# EasyEDA Pro project stm32h7手持mp3.eprj, board PCB2
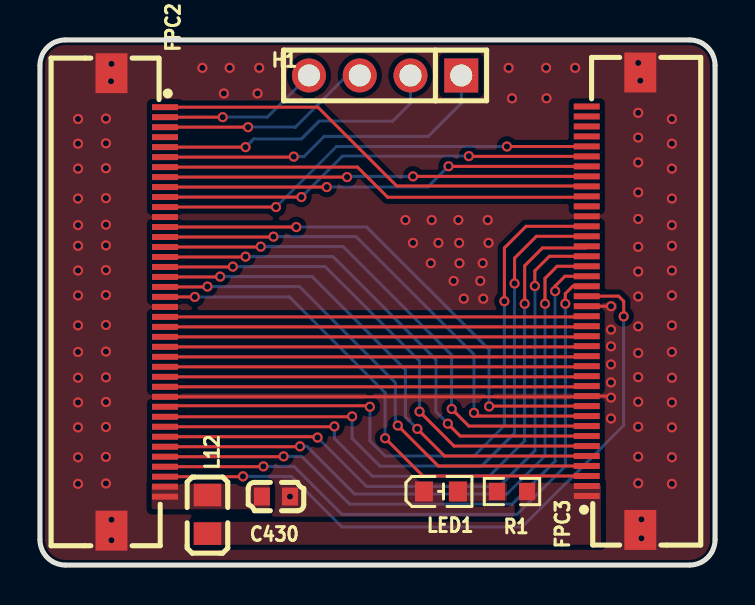
[diagram p4: board, top side]
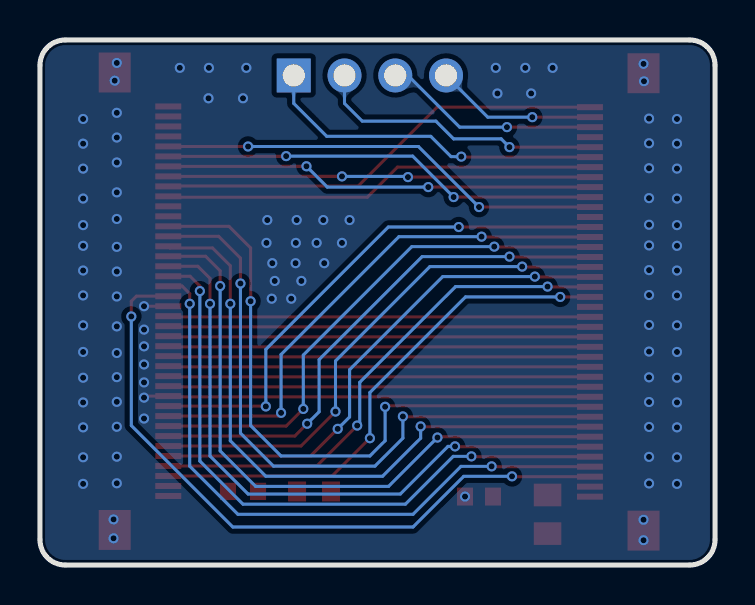
[diagram p5: board, bottom side, seen from below]

Outline 33.78 x 26.29 mm; copper layers: Top Layer, Bottom Layer. Coordinates in mm from the lower left corner of the outline.
Outline path: 0,25.02 0,1.27 arc(0.37,0.37) 1.27,0 32.51,0 arc(33.41,0.37) 33.78,1.27 33.78,25.02 arc(33.41,25.92) 32.51,26.29 1.27,26.29 arc(0.37,25.92) 0,25.02
Stack: Top Layer 0.035mm / Dielectric1 1.51mm FR4 er 4.5 / Bottom Layer 0.035mm

## Design rules (mm)
template: 自定义配置
spacing copperThickness1oz (default): track to track 0.102, other pairs 0.152 to 0.3
spacing copperThickness2oz: track to track 0.203, other pairs 0.152 to 0.3
track width copperThickness1oz (default): min 0.127, default 0.254, max 2.54
track width copperThickness2oz: min 0.203, default 0.254, max 2.54
differential pair differentialPair (default): width min 0.127, default 0.254, max 2.54; gap min 0.152, default 0.152
via viaSize (default): diameter min 0.5, default 0.61, max 10; hole min 0.3, default 0.305, max 6.3

## Placement (name value [footprint] x y rotation side)
C430  100nF  [C0603]  11.81 3.43 0 top
FPC2  AFC01-S40FCA-00  [FPC-SMD_AFC01-S40FCA-00]  4.92 13.17 270 top
FPC3  AFC01-S40FCA-00  [FPC-SMD_AFC01-S40FCA-00]  28.7 13.21 90 top
H1  PZ254V-11-04P  [HDR-TH_4P-P2.54-V-M]  17.27 24.51 180 top
L12  BLM21PG331SN1D  [L0805]  8.38 2.54 90 top
LED1  GL0603UR01  [LED0603-FD]  20.07 3.68 180 top
R1  1K  [R0603]  23.62 3.68 0 top

## Footprints (pads in the part's own frame, mm; a bottom-side part is the same pattern mirrored in y, then rotated)
C0603
  rect 0.8x0.9 smd: 1(-0.7,0) 2(0.7,0)
FPC-SMD_AFC01-S40FCA-00
  rect 0.3x1.3 smd: 1(-9.75,1.34) 2(-9.25,1.339) 3(-8.75,1.34) 4(-8.25,1.34) 5(-7.75,1.34) 6(-7.25,1.34) 7(-6.75,1.34) 8(-6.25,1.34) 9(-5.75,1.34) 10(-5.25,1.34) 11(-4.75,1.34) 12(-4.25,1.34) 13(-3.75,1.34) 14(-3.25,1.34) 15(-2.75,1.34) 16(-2.25,1.34) 17(-1.75,1.34) 18(-1.25,1.34) 19(-0.75,1.34) 20(-0.25,1.34) 21(0.25,1.34) 22(0.75,1.34) 23(1.25,1.34) 24(1.75,1.34) 25(2.25,1.34) 26(2.75,1.34) 27(3.25,1.34) 28(3.75,1.34) 29(4.25,1.34) 30(4.75,1.34) 31(5.25,1.34) 32(5.75,1.34) 33(6.25,1.34) 34(6.75,1.34) 35(7.25,1.34) 36(7.75,1.34) 37(8.25,1.34) 38(8.75,1.34) 39(9.25,1.34) 40(9.75,1.34)
  rect 2x1.6 smd: 41(-11.45,-1.34) 42(11.45,-1.34)
HDR-TH_4P-P2.54-V-M
  rect 1.7x1.7 hole 1.1: 1(-3.81,0)
  round 1.7 hole 1.1: 2(-1.27,0) 3(1.27,0) 4(3.81,0)
L0805
  rect 1.133x1.377 smd: 1(-0.966,0) 2(0.966,0)
LED0603-FD
  rect 0.9x1 smd: 1(-0.85,0) 2(0.85,0)
R0603
  rect 0.806x0.864 smd: 1(-0.753,0) 2(0.753,0)

## Nets
As in the schematic.

Pads without a net: FPC3 30 37 38 39 40

## Via types
v1: diameter 0.508, hole 0.305, Top Layer to Bottom Layer, 145 vias

## Routing (per net, layer and track width the routed paths; a pad name or vN(x,y) marks a point on that pad's centre or on a via; arc(x,y) is an arc through that point)
GND: length 23.6
  Top Layer w0.152: v1(28.57,8.38) 28.5,8.46 FPC3.11 27.33,8.42 FPC2.30 ; FPC3.20 v1(28.57,12.96)
  vias: v1(1.91,22.33) v1(1.91,21.1) v1(1.91,19.85) v1(1.91,18.35) v1(1.91,17.02) v1(1.91,15.98) v1(1.91,14.75) v1(1.91,13.5) v1(1.91,12) v1(1.91,10.67) v1(1.91,9.38) v1(1.91,8.14) v1(1.91,6.89) v1(1.91,5.4) v1(1.91,4.06) v1(3.3,22.35) v1(3.3,21.12) v1(3.3,19.87) v1(3.3,18.37) v1(3.3,17.04) v1(3.3,16) v1(3.3,14.77) v1(3.3,13.52) v1(3.3,12.02) v1(3.3,10.69) v1(3.3,9.4) v1(3.3,8.16) v1(3.3,6.91) v1(3.3,5.42) v1(3.3,4.08) v1(3.58,25.09) v1(3.56,24.22) v1(3.58,2.27) v1(3.58,1.24) v1(8.13,24.89) v1(9.2,23.61) v1(9.49,24.89) v1(10.89,23.61) v1(10.97,24.89) v1(12.51,3.43) v1(18.29,17.27) v1(18.67,16.13) v1(19.6,17.27) v1(19.56,15.11) v1(19.94,16.13) v1(20.7,14.22) v1(20.94,17.27) v1(20.98,16.13) v1(20.99,15.11) v1(21.21,13.34) v1(22.03,14.22) v1(22.16,15.11) v1(22.18,13.34) v1(22.41,17.27) v1(22.45,16.13) v1(23.46,24.89) v1(23.62,23.37) v1(25.33,24.89) v1(25.35,23.37) v1(26.78,24.89) v1(28.57,11.79) v1(28.57,10.95) v1(28.57,10.04) v1(28.57,9.14) v1(28.57,7.34) v1(29.94,25.14) v1(29.94,22.64) v1(29.94,21.4) v1(29.94,20.16) v1(29.94,18.66) v1(29.94,17.33) v1(29.94,15.93) v1(29.94,14.69) v1(29.94,13.45) v1(29.94,11.95) v1(29.94,10.62) v1(29.94,9.41) v1(29.94,8.17) v1(29.94,6.92) v1(29.94,5.43) v1(29.94,4.09) v1(30.04,24.25) v1(30.1,2.29) v1(30.1,1.34) v1(31.62,22.33) v1(31.62,21.1) v1(31.62,19.85) v1(31.62,18.35) v1(31.62,17.02) v1(31.62,15.98) v1(31.62,14.75) v1(31.62,13.5) v1(31.62,12) v1(31.62,10.67) v1(31.62,9.38) v1(31.62,8.14) v1(31.62,6.89) v1(31.62,5.4) v1(31.62,4.06)
BL_CTR: length 21.7
  Top Layer w0.152: FPC2.7 15.89,19.92 17.4,18.42 27.32,18.42 FPC3.31
CTP_INT: length 8.1
  Top Layer w0.152: FPC2.2 v1(9.14,22.42)
  Bottom Layer w0.152: H1.4 11.37,22.42 v1(9.14,22.42)
CTP_RST: length 17.3
  Top Layer w0.152: FPC2.6 12.68,20.42 v1(12.7,20.45)
  Bottom Layer w0.152: v1(12.7,20.45) 13.21,20.45 14.22,21.46 19.43,21.46 21.08,23.11 H1.1
CTP_SCL: length 10.8
  Top Layer w0.152: FPC2.3 v1(10.41,21.92)
  Bottom Layer w0.152: v1(10.41,21.92) 12.78,21.92 15.37,24.51 H1.3
CTP_SDA: length 14.6
  Top Layer w0.152: FPC2.5 v1(10.29,20.92)
  Bottom Layer w0.152: H1.2 18.54,23.11 17.65,22.23 13.97,22.23 13.08,21.34 10.7,21.34 v1(10.29,20.92)
LCD_B0: length 26.2
  Top Layer w0.152: FPC3.3 19.16,4.46 v1(17.27,6.35) ; FPC2.20 v1(7.75,13.42)
  Bottom Layer w0.152: v1(7.75,13.42) 12.48,13.42 17.27,8.64 v1(17.27,6.35)
LCD_B1: length 26
  Top Layer w0.152: v1(8.38,13.94) 8.36,13.92 FPC2.19 ; FPC3.4 19.93,4.96 v1(17.91,6.99)
  Bottom Layer w0.152: v1(8.38,13.94) 12.98,13.94 17.78,9.14 17.78,7.11 17.91,6.99
LCD_B2: length 26.2
  Top Layer w0.152: FPC3.5 20.24,5.46 v1(18.88,6.82) ; v1(9.02,14.44) 9,14.42 FPC2.18
  Bottom Layer w0.152: v1(9.02,14.44) 13.63,14.44 18.29,9.78 18.29,7.41 v1(18.88,6.82)
LCD_B3: length 26.3
  Top Layer w0.152: v1(9.65,14.94) 9.63,14.92 FPC2.17 ; FPC3.6 20.72,5.96 v1(18.99,7.68)
  Bottom Layer w0.152: v1(18.99,7.68) 18.99,10.22 14.27,14.94 v1(9.65,14.94)
LCD_B4: length 26.4
  Top Layer w0.152: v1(10.29,15.44) 10.27,15.42 FPC2.16 ; v1(20.41,7.08) 21.03,6.46 FPC3.7
  Bottom Layer w0.152: v1(10.29,15.44) 14.66,15.44 19.81,10.29 19.81,7.67 v1(20.41,7.08)
LCD_B5: length 26.4
  Top Layer w0.152: FPC3.8 21.46,6.96 v1(20.6,7.82) ; FPC2.15 11.03,15.92 v1(11.05,15.94)
  Bottom Layer w0.152: v1(20.6,7.82) 20.6,10.51 15.17,15.94 v1(11.05,15.94)
LCD_B6: length 26.5
  Top Layer w0.152: v1(21.72,7.62) 21.88,7.46 FPC3.9 ; FPC2.14 11.67,16.42 v1(11.68,16.44)
  Bottom Layer w0.152: v1(21.72,7.62) 21.72,10.54 15.82,16.44 v1(11.68,16.44)
LCD_B7: length 26.5
  Top Layer w0.152: v1(22.48,7.94) 22.5,7.96 FPC3.10 ; FPC2.13 v1(12.83,16.92)
  Bottom Layer w0.152: v1(22.48,7.94) 22.48,10.8 16.35,16.92 v1(12.83,16.92)
LCD_DEN: length 21.1
  Top Layer w0.152: v1(18.67,19.46) FPC3.33 ; FPC2.8 v1(15.37,19.42)
  Bottom Layer w0.152: v1(15.37,19.42) 15.4,19.46 v1(18.67,19.46)
LCD_G0: length 21.1
  Top Layer w0.152: FPC2.29 27.33,8.92 FPC3.12
LCD_G1: length 21.1
  Top Layer w0.152: FPC2.28 27.33,9.42 FPC3.13
LCD_G2: length 21.1
  Top Layer w0.152: FPC3.14 27.33,9.92 FPC2.27
LCD_G3: length 21.1
  Top Layer w0.152: FPC3.15 27.33,10.42 FPC2.26
LCD_G4: length 21.1
  Top Layer w0.152: FPC2.25 27.33,10.92 FPC3.16
LCD_G5: length 21.1
  Top Layer w0.152: FPC3.17 27.33,11.42 FPC2.24
LCD_G6: length 21.1
  Top Layer w0.152: FPC2.23 27.33,11.92 FPC3.18
LCD_G7: length 21.1
  Top Layer w0.152: FPC3.19 27.33,12.42 FPC2.22
LCD_HSYNC: length 22
  Top Layer w0.152: FPC3.35 21.48,20.46 v1(21.46,20.47) ; FPC2.10 v1(13.08,18.42)
  Bottom Layer w0.152: v1(21.46,20.47) 15.13,20.47 v1(13.08,18.42)
LCD_PCLK: length 22.4
  Top Layer w0.152: FPC3.36 27.36,20.96 v1(23.37,20.96) ; FPC2.11 v1(11.81,17.92)
  Bottom Layer w0.152: v1(23.37,20.96) 14.84,20.96 v1(11.81,17.92)
LCD_R0: length 34.3
  Top Layer w0.152: FPC3.21 27.37,13.46 28.96,13.46 29.21,13.21 v1(29.21,12.45) ; v1(10.16,4.44) 10.14,4.42 FPC2.38
  Bottom Layer w0.152: v1(10.16,4.44) 12.58,4.44 15.11,1.91 24.13,1.91 29.21,6.99 v1(29.21,12.45)
LCD_R1: length 31.9
  Top Layer w0.152: FPC3.22 27.35,13.97 26.67,13.97 26.29,13.59 v1(26.29,13.08) ; v1(11.18,4.94) 11.16,4.92 FPC2.37
  Bottom Layer w0.152: v1(11.18,4.94) 12.71,4.94 15.11,2.54 23.88,2.54 26.29,4.95 v1(26.29,13.08)
LCD_R2: length 32
  Top Layer w0.152: FPC2.36 12.17,5.42 v1(12.19,5.44) ; v1(25.78,13.72) 25.78,13.97 26.27,14.46 FPC3.23
  Bottom Layer w0.152: v1(12.19,5.44) 13.1,5.44 15.49,3.05 23.62,3.05 25.78,5.21 v1(25.78,13.72)
LCD_R3: length 32
  Top Layer w0.152: v1(13.01,5.94) 12.99,5.92 FPC2.35 ; FPC3.24 25.88,14.96 25.27,14.35 v1(25.27,13.08)
  Bottom Layer w0.152: v1(25.27,13.08) 25.27,5.46 23.37,3.56 15.75,3.56 13.36,5.94 v1(13.01,5.94)
LCD_R4: length 32.2
  Top Layer w0.152: v1(13.89,6.38) 13.85,6.42 FPC2.34 ; v1(24.76,13.97) 24.76,14.73 25.49,15.46 FPC3.25
  Bottom Layer w0.152: v1(24.76,13.97) 24.76,5.72 22.99,3.94 16.34,3.94 v1(13.89,6.38)
LCD_R5: length 32.4
  Top Layer w0.152: v1(24.26,13.08) 24.26,14.99 25.15,15.88 27.28,15.88 FPC3.26 ; FPC2.33 14.71,6.92 v1(14.73,6.94)
  Bottom Layer w0.152: v1(24.26,13.08) 24.26,6.22 22.48,4.45 16.64,4.45 14.73,6.35 v1(14.73,6.94)
LCD_R6: length 32.7
  Top Layer w0.152: FPC3.27 24.84,16.46 23.75,15.37 v1(23.75,14.1) ; v1(15.62,7.44) 15.6,7.42 FPC2.32
  Bottom Layer w0.152: v1(23.75,14.1) 23.75,6.6 22.1,4.95 17.02,4.95 15.62,6.35 v1(15.62,7.44)
LCD_R7: length 33.1
  Top Layer w0.152: FPC2.31 6.5,7.92 6.55,7.98 16.46,7.98 v1(16.51,7.92) ; FPC3.28 24.32,16.96 23.24,15.88 v1(23.24,13.21)
  Bottom Layer w0.152: v1(16.51,7.92) 16.51,6.22 17.27,5.46 21.72,5.46 23.24,6.99 v1(23.24,13.21)
LCD_RST: length 22.7
  Top Layer w0.152: FPC2.1 13.91,22.92 17.85,18.98 27.34,18.98 FPC3.32
LCD_VSYNC: length 21.5
  Top Layer w0.152: FPC2.9 v1(14.35,18.92) ; v1(20.45,19.97) 20.45,19.96 FPC3.34
  Bottom Layer w0.152: v1(14.35,18.92) 19.41,18.92 v1(20.45,19.97)

## Copper pours and planes (outline as drawn; the poured copper is in the pictures)
GND on Top Layer: -1.91,27.56 35.43,27.56 35.43,-1.52 -1.91,-1.52
GND on Bottom Layer: -4.19,30.23 38.48,30.23 38.48,-2.54 -4.19,-2.54
VCC5V on Top Layer: 7.75,2.16 28.07,2.16 28.07,1.02 7.75,1.02
VCC5V on Top Layer: 24.05,4.13 28.07,4.13 28.07,3.18 24.05,3.18
VCC5V on Top Layer: 24,4.06 28.07,4.06 28.07,1.13 24,1.13
$1N360 on Top Layer: 5.59,4.06 11.49,4.06 11.49,2.79 5.59,2.79
$1N1307 on Top Layer: 20.45,4.19 23.37,4.19 23.37,3.18 20.45,3.18

Small or netless copper shapes (teardrops, artwork), in the pictures only: 17 on Top Layer, 28 on Bottom Layer
